# Altium schematic sheet config-power.SchDoc: Config FPGA - Power
size Letter; CompanyName: Brinton Engineering, LLC; Address1: 3479 Edison Way; Address2: Menlo Park CA 94025; Address3: +1 (877) 778-8435; Address4: brintonengineering.com; Revision: 1; SheetNumber: 1; SheetTotal: 1
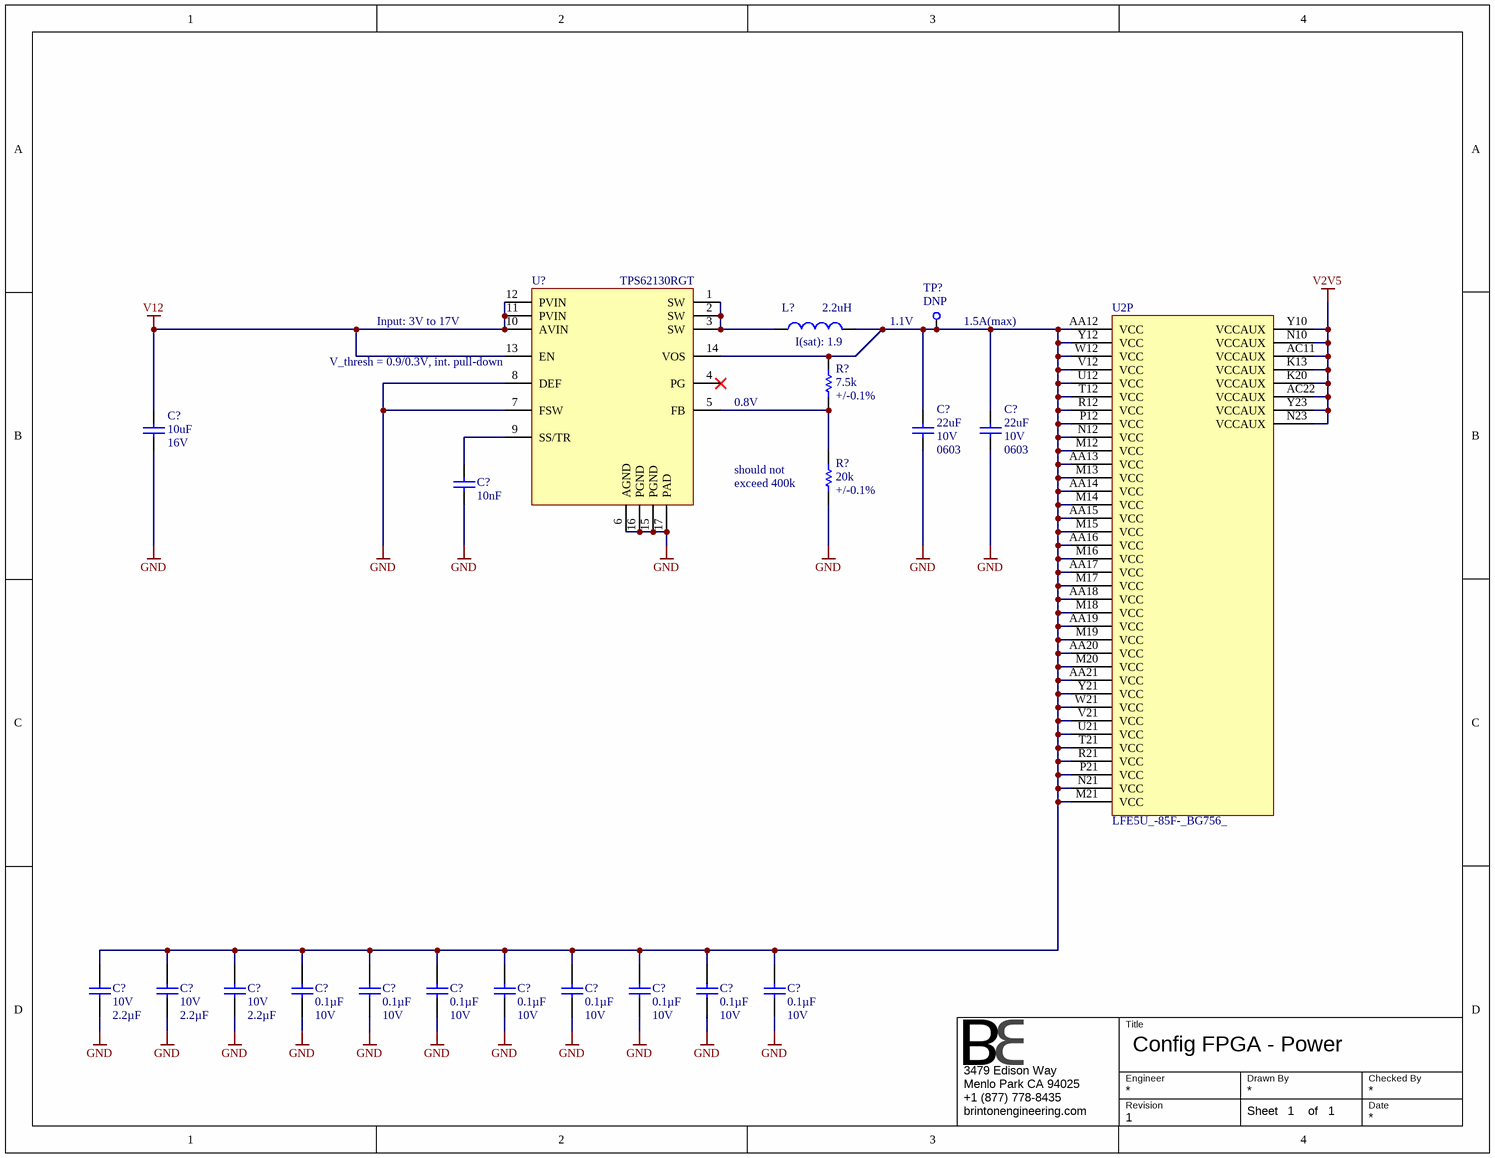
[diagram p0: config-power.SchDoc]

## Parts
(Parts that share a designator on the sheet are numbered #1, #2 ... from top to bottom, then left to right.)
C?#1  value 22uF  Voltage: 10V  [0603]  (hidden comment: C1608X5R1A226M080AC)
C?#2  value 22uF  Voltage: 10V  [0603]  (hidden comment: C1608X5R1A226M080AC)
C?#3  value 10uF  Voltage: 16V  [0603]  (hidden comment: CAP 10UF 0603)
C?#4  value 10nF  [0201]  (hidden comment: CAP 10NF 0201)
C?#5  Voltage - Rated: 10V  Capacitance: 2.2µF  [CAPC1608X90N]  (hidden comment: GRM188R71A225KE15D)
C?#6  Voltage - Rated: 10V  Capacitance: 2.2µF  [CAPC1608X90N]  (hidden comment: GRM188R71A225KE15D)
C?#7  Voltage - Rated: 10V  Capacitance: 2.2µF  [CAPC1608X90N]  (hidden comment: GRM188R71A225KE15D)
C?#8  Capacitance: 0.1µF  Voltage - Rated: 10V  [CAPC1005X56N]  (hidden comment: GRM155R71A104KA01J)
C?#9  Capacitance: 0.1µF  Voltage - Rated: 10V  [CAPC1005X56N]  (hidden comment: GRM155R71A104KA01J)
C?#10  Capacitance: 0.1µF  Voltage - Rated: 10V  [CAPC1005X56N]  (hidden comment: GRM155R71A104KA01J)
C?#11  Capacitance: 0.1µF  Voltage - Rated: 10V  [CAPC1005X56N]  (hidden comment: GRM155R71A104KA01J)
C?#12  Capacitance: 0.1µF  Voltage - Rated: 10V  [CAPC1005X56N]  (hidden comment: GRM155R71A104KA01J)
C?#13  Capacitance: 0.1µF  Voltage - Rated: 10V  [CAPC1005X56N]  (hidden comment: GRM155R71A104KA01J)
C?#14  Capacitance: 0.1µF  Voltage - Rated: 10V  [CAPC1005X56N]  (hidden comment: GRM155R71A104KA01J)
C?#15  Capacitance: 0.1µF  Voltage - Rated: 10V  [CAPC1005X56N]  (hidden comment: GRM155R71A104KA01J)
L?  value 2.2uH  I(sat): 1.9  [ASPI-3010FS]  (hidden comment: ASPI-0310FS-2R2M-T2)
R?#1  value 7.5k  Tolerance: +/-0.1%  [RESC1608X55N]  (hidden comment: RES 0603 7.5k 0.1%)
R?#2  value 20k  Tolerance: +/-0.1%  [RESC1608X55N]  (hidden comment: RES 0603 20k 0.1%)
TP?  Do Not Place: DNP  [TEST_POINT]  (hidden comment: TEST_POINT)
U2  LFE5U_-85F-_BG756_  [caBGA756]  (part P of 19)
U?  TPS62130RGT  [S-PQFP-8N]

## Nets
GND: C?#1.1 C?#2.1 C?#3.1 C?#4.2 C?#5.1 C?#6.1 C?#7.1 C?#8.1 C?#9.1 C?#10.1 C?#11.1 C?#12.1 C?#13.1 C?#14.1 C?#15.1 R?#2.1 U?.6(AGND) U?.7(FSW) U?.8(DEF) U?.15(PGND) U?.16(PGND) U?.17(PAD)
V2V5: U2.AC11(VCCAUX) U2.AC22(VCCAUX) U2.K13(VCCAUX) U2.K20(VCCAUX) U2.N10(VCCAUX) U2.N23(VCCAUX) U2.Y10(VCCAUX) U2.Y23(VCCAUX)
V12: C?#3.2 U?.10(AVIN) U?.11(PVIN) U?.12(PVIN) U?.13(EN)
NetC?#1_2: C?#1.2 C?#2.2 C?#5.2 C?#6.2 C?#7.2 C?#8.2 C?#9.2 C?#10.2 C?#11.2 C?#12.2 C?#13.2 C?#14.2 C?#15.2 L?.2 R?#1.2 TP?.1 U2.AA12(VCC) U2.AA13(VCC) U2.AA14(VCC) U2.AA15(VCC) U2.AA16(VCC) U2.AA17(VCC) U2.AA18(VCC) U2.AA19(VCC) U2.AA20(VCC) U2.AA21(VCC) U2.M12(VCC) U2.M13(VCC) U2.M14(VCC) U2.M15(VCC) U2.M16(VCC) U2.M17(VCC) U2.M18(VCC) U2.M19(VCC) U2.M20(VCC) U2.M21(VCC) U2.N12(VCC) U2.N21(VCC) U2.P12(VCC) U2.P21(VCC) U2.R12(VCC) U2.R21(VCC) U2.T12(VCC) U2.T21(VCC) U2.U12(VCC) U2.U21(VCC) U2.V12(VCC) U2.V21(VCC) U2.W12(VCC) U2.W21(VCC) U2.Y12(VCC) U2.Y21(VCC) U?.14(VOS)
NetC?#4_1: C?#4.1 U?.9(SS/TR)
NetL?_1: L?.1 U?.1(SW) U?.2(SW) U?.3(SW)
NetR?#1_1: R?#1.1 R?#2.2 U?.5(FB)

Not connected (* = marked no-connect by the designer): U? 4(PG)*

## Notes on the sheet
- (near U?) V_thresh = 0.9/0.3V, int. pull-down
- Input: 3V to 17V
- (near TP?) 1.1V
- (near TP?) 1.5A(max)
- (near U?) 0.8V
- should not
- exceed 400k
- Title
- Engineer
- Revision
- Drawn By
- Checked By
- Date
- Sheet
- of

## Library data of the parts
C?#1 C?#2 = CAP: Ceramic Capacitor 22uF +/-20% 10V X5R SMD 0603; Manufacturer: TDK Corporation; Tr: -55:85; Manufacturer P/N: C1608X5R1A226M080AC; Tolerance: +/-20%
C?#3 = CAP: Ceramic Capacitor 10uF +/-20% 16V X5R 0603; Manufacturer: Taiyo Yuden; Manufacturer P/N: EMK107BBJ106MA-T; Tolerance: *; Footprint: *; Tr: *; Distributor: Digi-Key; Distributor P/N: *
C?#4 = CAP: Ceramic Capacitor 10nF +/-10% 10V X5R 0201; Manufacturer: TDK Corporation; Manufacturer P/N: C0603X5R1A103K030BA; Tolerance: *; Voltage: 10V; Footprint: *; Tr: *; Distributor: Digi-Key; Distributor P/N: *
C?#5-C?#7 = GRM188R71A225KE15D: CAP CER 2.2UF 10V 10% X7R 0603; Manufacturer: Murata Electronics North America; Manufacturer P/N: GRM188R71A225KE15D; Operating Temperature: -55°C ~ 125°C; Thickness (Max): 0.035" (0.90mm); Tolerance: ±10%; Package / Case: 0603 (1608 Metric); Temperature Coefficient: X7R; Supplier 1: Newark; Supplier 2: Digi-Key; RoHS: RoHS Compliant; Size / Dimension: 0.063" L x 0.031" W (1.60mm x 0.80mm); Mounting Type: Surface Mount, MLCC; ComponentLink1URL: http://www.murata.com/~/media/webrenewal/support/library/catalog/products/capacitor/mlcc/c02e.ashx; ComponentLink1Description: http://www.murata.com/~/media/webrenewal/support/library/catalog/products/capacitor/mlcc/c02e.ashx; Supplier Part Number 1: 72R4209; Supplier Part Number 2: 490-4520-1-ND
C?#8-C?#15 = GRM155R71A104KA01J: CAP CER 0.1UF 10V 10% X7R 0402; Manufacturer: Murata Electronics North America; Manufacturer P/N: GRM155R71A104KA01J; Operating Temperature: -55°C ~ 125°C; Thickness (Max): 0.022" (0.55mm); Size / Dimension: 0.039" L x 0.020" W (1.00mm x 0.50mm); RoHS: RoHS Compliant; Mounting Type: Surface Mount, MLCC; Supplier 1: Digi-Key; ComponentLink1URL: http://www.murata.com/~/media/webrenewal/support/library/catalog/products/capacitor/mlcc/c02e.ashx; ComponentLink1Description: http://www.murata.com/~/media/webrenewal/support/library/catalog/products/capacitor/mlcc/c02e.ashx; Supplier Part Number 1: 490-6322-1-ND; Temperature Coefficient: X7R; Package / Case: 0402 (1005 Metric); Tolerance: ±10%
L? = COIL: Wirewound Inductor 2.2uH +/-20% 1.9A SMD 2518; Manufacturer: Abracon; Manufacturer P/N: ASPI-0310FS-2R2M-T2
R?#1 = RES 0603 10k 1%: Thick Film Resistor 7.5k Ohms +/-0.1% 0.1W 75V SMD 0603; Manufacturer: Panasonic - ECG; Manufacturer P/N: ERA-3APB752V; Tcr: +/-15; Tr: -55:+125; Alternatives: *; Voltage: 75V; Power: 0.1W; Footprint: 0603; P/N: ERA-3APB752V
R?#2 = RES 0603 10k 1%: Thick Film Resistor 20k Ohms +/-0.1% 0.1W 75V SMD 0603; Manufacturer: Panasonic - ECG; Manufacturer P/N: ERA-3APB203V; Tcr: +/-15; Tr: -55:+125; Alternatives: *; Voltage: 75V; Power: 0.1W; Footprint: 0603; P/N: ERA-3APB203V
TP? = TEST_POINT: Thruhole Miniature Test Point; Manufacturer P/N: 5000; Manufacturer: Keystone Electronics Corp
U2 = LFE5U_-85F-_BG756_: ECP5 FPGA, 85k LUT, 756-caBGA; Manufacturer: Lattice Semiconductor; Manufacturer P/N: LFE5U_-85F-_BG756_
U? = TPS62130RGT: 3-17V 3A Step-Down Converter VQFN; Manufacturer: Texas Instruments; Manufacturer P/N: TPS62130RGT